# Altium schematic sheet Nixie_MCU.SchDoc
size 420 x 297 mm; ApprovedBy: Софин; CheckedBy: Васильев; Author: Боярцев; DrawnBy: Боярцев; Organization: ТПК "Аргус-НВ"; DocumentNumber: АЦСД.687281.258-01Э3; SheetNumber: 1; SheetTotal: 2; Title1str: Плата управления; PageSetup: Record=PageOptions|CenterHorizontal=False|CenterVertical=False|PrintScale=0.95|XCorrection=0.00|YCorrection=0.00|PrintKind=1|BorderSize=5000000|LeftOffset=0|BottomOffset=0|Orientation=1|PaperLength=1000|PaperWidth=1000|Scale=100|PaperSource=15|PrintQuality=600|MediaType=1|DitherType=10|PaperKind=A4|PrintScaleMode=1; Title2str: ИТП; ProcessInspection: Белов; NormInspection: Печенева; DocumentType: Схема электрическая принципиальная
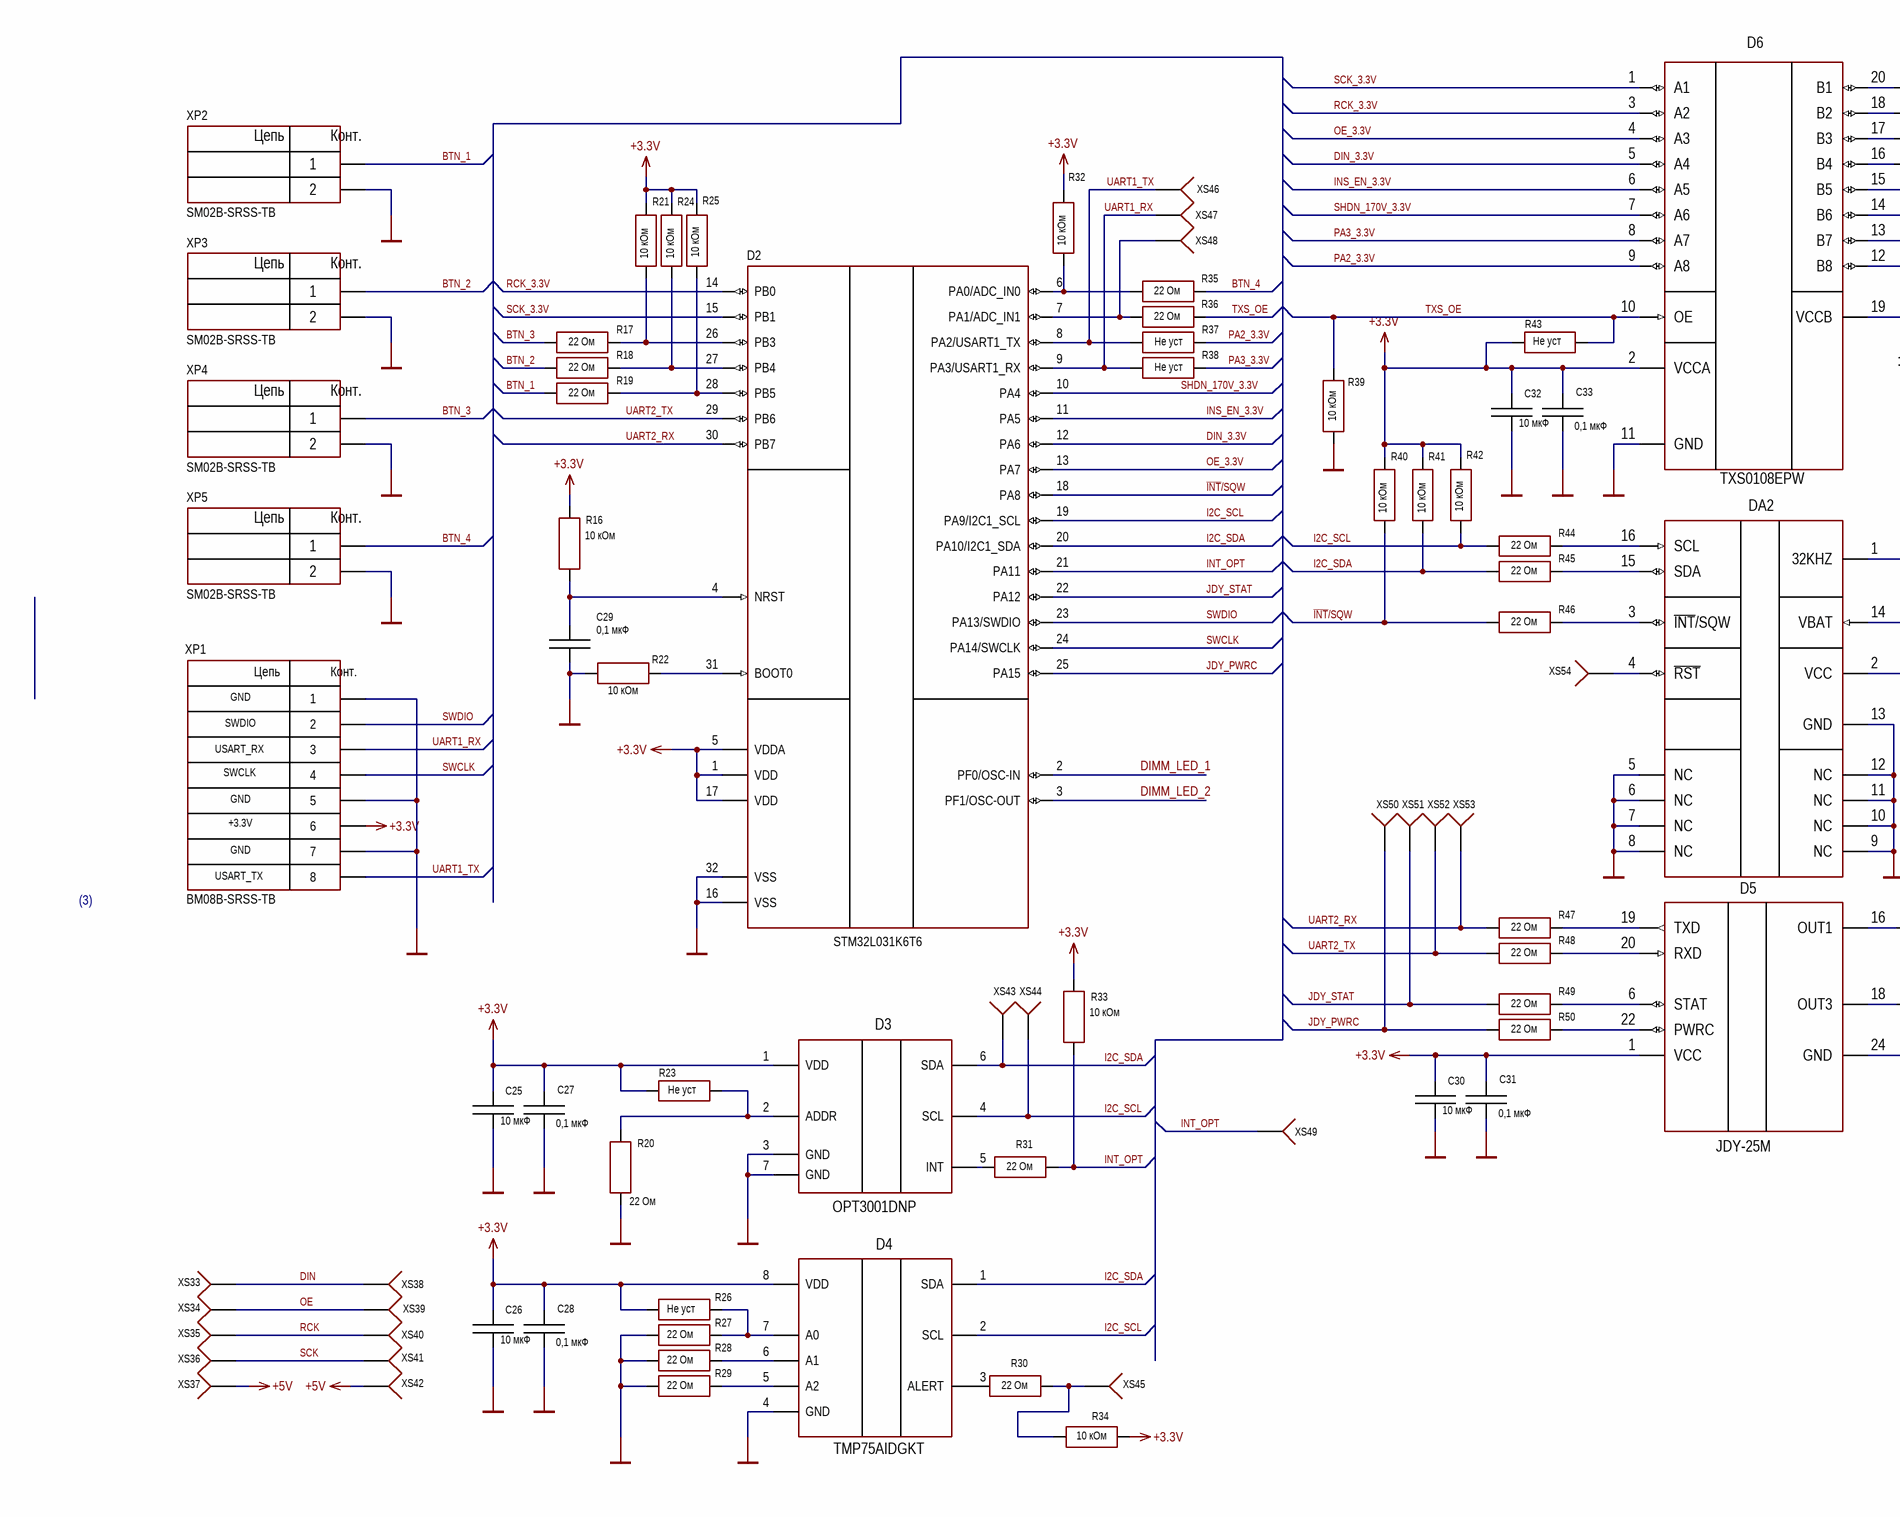
[diagram p0: Nixie_MCU.SchDoc, left]
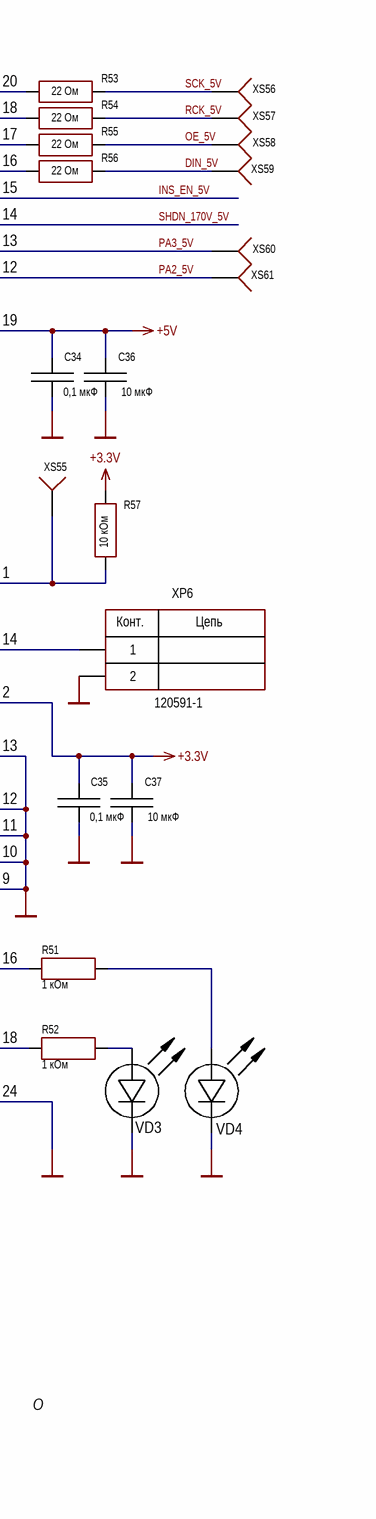
[diagram p1: Nixie_MCU.SchDoc, right]

## Parts
C25  value 10 мкФ  [CAP: 0603R]
C26  value 10 мкФ  [CAP: 0603R]
C27  value 0,1 мкФ  [CAP: 0402R]
C28  value 0,1 мкФ  [CAP: 0402R]
C29  value 0,1 мкФ  [CAP: 0402R]
C30  value 10 мкФ  [CAP: 0603R]
C31  value 0,1 мкФ  [CAP: 0402R]
C32  value 10 мкФ  [CAP: 0603R]
C33  value 0,1 мкФ  [CAP: 0402R]
C34  value 0,1 мкФ  [CAP: 0402R]
C35  value 0,1 мкФ  [CAP: 0402R]
C36  value 10 мкФ  [CAP: 0603R]
C37  value 10 мкФ  [CAP: 0603R]
D2  PartNumber: STM32L031K6T6  [32-LQFP]
D3  PartNumber: OPT3001DNP  [6-USON (OPT)]
D4  (no value)  [8-MSOP]
D5  (no value)  [MOD: JDY-25M]
D6  (no value)  [20-TSSOP]
DA2  (no value)  [16-SOIC]
R16  value 10 кОм  [RES: 0402_ASK]
R17  value 22 Ом  [RES: 0402_ASK]
R18  value 22 Ом  [RES: 0402_ASK]
R19  value 22 Ом  [RES: 0402_ASK]
R20  value 22 Ом  [RES: 0402_ASK]
R21  value 10 кОм  [RES: 0402_ASK]
R22  value 10 кОм  [RES: 0402_ASK]
R23  value Не уст  [RES: 0402_ASK]
R24  value 10 кОм  [RES: 0402_ASK]
R25  value 10 кОм  [RES: 0402_ASK]
R26  value Не уст  [RES: 0402_ASK]
R27  value 22 Ом  [RES: 0402_ASK]
R28  value 22 Ом  [RES: 0402_ASK]
R29  value 22 Ом  [RES: 0402_ASK]
R30  value 22 Ом  [RES: 0402_ASK]
R31  value 22 Ом  [RES: 0402_ASK]
R32  value 10 кОм  [RES: 0402_ASK]
R33  value 10 кОм  [RES: 0402_ASK]
R34  value 10 кОм  [RES: 0402_ASK]
R35  value 22 Ом  [RES: 0402_ASK]
R36  value 22 Ом  [RES: 0402_ASK]
R37  value Не уст  [RES: 0402_ASK]
R38  value Не уст  [RES: 0402_ASK]
R39  value 10 кОм  [RES: 0402_ASK]
R40  value 10 кОм  [RES: 0402_ASK]
R41  value 10 кОм  [RES: 0402_ASK]
R42  value 10 кОм  [RES: 0402_ASK]
R43  value Не уст  [RES: 0402_ASK]
R44  value 22 Ом  [RES: 0402_ASK]
R45  value 22 Ом  [RES: 0402_ASK]
R46  value 22 Ом  [RES: 0402_ASK]
R47  value 22 Ом  [RES: 0402_ASK]
R48  value 22 Ом  [RES: 0402_ASK]
R49  value 22 Ом  [RES: 0402_ASK]
R50  value 22 Ом  [RES: 0402_ASK]
R51  value 1 кОм  [RES: 0402_ASK]
R52  value 1 кОм  [RES: 0402_ASK]
R53  value 22 Ом  [RES: 0402_ASK]
R54  value 22 Ом  [RES: 0402_ASK]
R55  value 22 Ом  [RES: 0402_ASK]
R56  value 22 Ом  [RES: 0402_ASK]
R57  value 10 кОм  [RES: 0402_ASK]
VD3  (no value)  [LED: 0603B]
VD4  (no value)  [LED: 0603B]
XP1  BM08B-SRSS-TB  [CON: BM08B-SRSS-TB]
XP2  (no value)  [CON: SM02B-SRSS-TB]
XP3  (no value)  [CON: SM02B-SRSS-TB]
XP4  (no value)  [CON: SM02B-SRSS-TB]
XP5  (no value)  [CON: SM02B-SRSS-TB]
XP6  120591-1  [CON: 120591-1 (CR2032)]
XS33  (no value)  [CON: PLD-1]
XS34  (no value)  [CON: PLD-1]
XS35  (no value)  [CON: PLD-1]
XS36  (no value)  [CON: PLD-1]
XS37  (no value)  [CON: PLD-1]
XS38  (no value)  [CON: PLD-1]
XS39  (no value)  [CON: PLD-1]
XS40  (no value)  [CON: PLD-1]
XS41  (no value)  [CON: PLD-1]
XS42  (no value)  [CON: PLD-1]
XS43  (no value)  [CON: PLD-1]
XS44  (no value)  [CON: PLD-1]
XS45  (no value)  [CON: PLD-1]
XS46  (no value)  [CON: PLD-1]
XS47  (no value)  [CON: PLD-1]
XS48  (no value)  [CON: PLD-1]
XS49  (no value)  [CON: PLD-1]
XS50  (no value)  [CON: PLD-1]
XS51  (no value)  [CON: PLD-1]
XS52  (no value)  [CON: PLD-1]
XS53  (no value)  [CON: PLD-1]
XS54  (no value)  [CON: PLD-1]
XS55  (no value)  [CON: PLD-1]
XS56  (no value)  [CON: PLD-1]
XS57  (no value)  [CON: PLD-1]
XS58  (no value)  [CON: PLD-1]
XS59  (no value)  [CON: PLD-1]
XS60  (no value)  [CON: PLD-1]
XS61  (no value)  [CON: PLD-1]

## Nets
+3.3V: C25.2 C26.2 C27.2 C28.2 C30.2 C31.2 C32.2 C33.2 C35.2 C37.2 D2.1(VDD) D2.5(VDDA) D2.17(VDD) D3.1(VDD) D4.8(VDD) D5.1(VCC) D6.2(VCCA) DA2.2(VCC) R16.1 R21.1 R23.1 R24.1 R25.1 R26.2 R32.1 R33.2 R34.2 R40.1 R41.1 R42.1 R43.2 R57.1 XP1.6
+5V: C34.2 C36.2 D6.19(VCCB) XS37.1 XS42.1
GND: C25.1 C26.1 C27.1 C28.1 C29.1 C30.1 C31.1 C32.1 C33.1 C34.1 C35.1 C36.1 C37.1 D2.16(VSS) D2.32(VSS) D3.3(GND) D3.7(GND) D4.4(GND) D5.24(GND) D6.11(GND) DA2.5(NC) DA2.6(NC) DA2.7(NC) DA2.8(NC) DA2.9(NC) DA2.10(NC) DA2.11(NC) DA2.12(NC) DA2.13(GND) R20.1 R22.2 R27.2 R28.2 R29.2 R39.1 VD3.2(C) VD4.2(C) XP1.1 XP1.5 XP1.7 XP2.2 XP3.2 XP4.2 XP5.2 XP6.2
BTN_1: R19.1 XP2.1
BTN_2: R18.1 XP3.1
BTN_3: R17.1 XP4.1
BTN_4: R35.1 XP5.1
DIMM_LED_1: D2.2(PF0/OSC-IN)
DIMM_LED_2: D2.3(PF1/OSC-OUT)
DIN: XS33.1 XS38.1
DIN_3.3V: D2.12(PA6) D6.5(A4)
DIN_5V: R56.2 XS59.1
I2C_SCL: D2.19(PA9/I2C1_SCL) D3.4(SCL) D4.2(SCL) R42.2 R44.1 XS44.1
I2C_SDA: D2.20(PA10/I2C1_SDA) D3.6(SDA) D4.1(SDA) R41.2 R45.1 XS43.1
~{INT}/SQW: D2.18(PA8) R40.2 R46.1
INS_EN_3.3V: D2.11(PA5) D6.6(A5)
INS_EN_5V: D6.15(B5)
INT_OPT: D2.21(PA11) R31.2 R33.1 XS49.1
JDY_PWRC: D2.25(PA15) R50.1 XS50.1
JDY_STAT: D2.22(PA12) R49.1 XS51.1
OE: XS34.1 XS39.1
OE_3.3V: D2.13(PA7) D6.4(A3)
OE_5V: R55.2 XS58.1
PA2_3.3V: D6.9(A8) R37.2
PA2_5V: D6.12(B8) XS61.1
PA3_3.3V: D6.8(A7) R38.2
PA3_5V: D6.13(B7) XS60.1
RCK: XS35.1 XS40.1
RCK_3.3V: D2.14(PB0) D6.3(A2)
RCK_5V: R54.2 XS57.1
SCK: XS36.1 XS41.1
SCK_3.3V: D2.15(PB1) D6.1(A1)
SCK_5V: R53.2 XS56.1
SHDN_170V_3.3V: D2.10(PA4) D6.7(A6)
SHDN_170V_5V: D6.14(B6)
SWCLK: D2.24(PA14/SWCLK) XP1.4
SWDIO: D2.23(PA13/SWDIO) XP1.2
TXS_OE: D6.10(OE) R36.1 R39.2 R43.1
UART1_RX: D2.9(PA3/USART1_RX) R38.1 XP1.3 XS47.1
UART1_TX: D2.8(PA2/USART1_TX) R37.1 XP1.8 XS46.1
UART2_RX: D2.30(PB7) R47.1 XS53.1
UART2_TX: D2.29(PB6) R48.1 XS52.1
NetC29_2: C29.2 D2.4(NRST) R16.2
NetD2_6: D2.6(PA0/ADC_IN0) R32.2 R35.2
NetD2_7: D2.7(PA1/ADC_IN1) R36.2 XS48.1
NetD2_26: D2.26(PB3) R17.2 R21.2
NetD2_27: D2.27(PB4) R18.2 R24.2
NetD2_28: D2.28(PB5) R19.2 R25.2
NetD2_31: D2.31(BOOT0) R22.1
NetD3_2: D3.2(ADDR) R20.2 R23.2
NetD3_5: D3.5(INT) R31.1
NetD4_3: D4.3(ALERT) R30.1
NetD4_5: D4.5(A2) R29.1
NetD4_6: D4.6(A1) R28.1
NetD4_7: D4.7(A0) R26.1 R27.1
NetD5_6: D5.6(STAT) R49.2
NetD5_16: D5.16(OUT1) R51.2
NetD5_18: D5.18(OUT3) R52.2
NetD5_19: D5.19(TXD) R47.2
NetD5_20: D5.20(RXD) R48.2
NetD5_22: D5.22(PWRC) R50.2
NetD6_16: D6.16(B4) R56.1
NetD6_17: D6.17(B3) R55.1
NetD6_18: D6.18(B2) R54.1
NetD6_20: D6.20(B1) R53.1
NetDA2_1: DA2.1(32KHZ) R57.2 XS55.1
NetDA2_3: DA2.3(~{INT}/SQW) R46.2
NetDA2_4: DA2.4(~{RST}) XS54.1
NetDA2_14: DA2.14(VBAT) XP6.1
NetDA2_15: DA2.15(SDA) R45.2
NetDA2_16: DA2.16(SCL) R44.2
NetR30_2: R30.2 R34.1 XS45.1
NetR51_1: R51.1 VD4.1(A)
NetR52_1: R52.1 VD3.1(A)

## Notes on the sheet
- GND
- USART_RX
- SWDIO
- SWCLK
- +3.3V
- USART_TX
- (3)
- O
- Перв. примен.
- Справ. №
- Подп. дата
- Инв. № дубл.
- Взам. инв. №
- Подп. и дата
- Изм.
- Разраб.
- Лист
- № докум.
- Боярцев
- Подп.
- Дата
- Лит.
- Масса
- Масштаб
- Пров.
- Т.контр.
- Васильев
- Схема электрическая принципиальная
- Листов
- Инв. № подл.
- Н.контр.
- Утв.
- Коровин
- ООО ТПК "Аргус-НВ"
- ALTIUM GOSTBOM2.0 KEV
- Копировал
- Формат А3
- (in symbol 120591-1) Конт.; Цепь
- (in symbol BM08B-SRSS-TB) Цепь; Конт.
- (in symbol SM02B-SRSS-TB) Цепь; Конт.

## Library data of the parts
C25 C26 C30 C32 C36 C37 = Ceramic_0603: Manufacturer: Yageo; ValueManufacturerPartNumber: Ceramic capacitor, 10 мкФ, X7R, ±10%, 16V, 0603, -55...+125°C; TypeCapacitor: Ceramic capacitor; Tolerance: ±10%; TypeDielectric: X7R; Voltage: 16V; Package: 0603; Temperature: -55...+125°C; Перечень: ="Value"+' '+"Tolerance"+', '+"Volt"+', '+"TypeDielectric"+',  '+"Package"
C27-C29 C31 C33-C35 = Ceramic_0402: Manufacturer: Murata; PartNumber: GCM155R71H104KE02#; TypeCapacitor: Ceramic capacitor; Tolerance: ± 10 %; TypeDielectric: X7R; Volt: 50 В; Перечень: 0,1 мкФ ± 10 %, 50 В, X7R, 0402; Package: 0402; ValueManufacturerPartNumber: =TypeCapacitor+', '+Value+', '+TypeDielectric+', '+Tolerance+', '+Voltage+', '+Package+', '+Temperature; Temperature: -55...+125°C
D2 = STM32F030K6T6: Cortex-M0; Manufacturer: STMicroelectronics; ValueManufacturerPartNumber: IC microcontroller, 32-Bit, Cortex-M0, 48MHz, 32KB, 4KB, 2.4...3.6V, -40...+85°C, 32-LQFP; Supply: 2.4...3.6V; Speed: 48MHz; CoreSize: 32-Bit; MemoryROM: 32KB; MemoryRAM: 4KB; HelpURL: https://www.digikey.com/product-detail/en/stmicroelectronics/STM32F031K4U6/497-13621-ND/3947373; Package: 32-LQFP; ComponentType: IC microcontroller; Temperature: -40...+85°C; CoreProcessor: Cortex-M0; Перечень: STM32L031K6T6
D3 = OPT3001IDNPQ1: Ambient Light Sensor; Manufacturer: Texas Instruments; VoltageInput: 1.6 V to 3.6 V; HelpURL: https://www.ti.com/lit/ds/symlink/opt3001.pdf?ts=1656114666246; Package: USON (6); ComponentType: Ambient Light Sensor; ValueManufacturerPartNumber: =ComponentType+', '+VoltageInput+', '+MaxDropout+', '+VoltageOutput+', '+CurrentOutput+', '+Temperature+', '+Package; Temperature: -40…+85
D4 = TMP75AIDGKT: Digital Temperature Sensor; Manufacturer: Texas Instruments; VoltageInput: 2.7V to 5.5V; HelpURL: https://www.elitan.ru/pdf/0/2/0/5/0/02050737.pdf; Package: MSOP-8; ComponentType: Digital Temperature Sensor; ValueManufacturerPartNumber: =ComponentType+', '+VoltageInput+', '+MaxDropout+', '+VoltageOutput+', '+CurrentOutput+', '+Temperature+', '+Package; Temperature: -40…+85; PartNumber: TMP75AIDGKT
D5 = JDY-25M: bluetooth module; ValueManufacturerPartNumber: bluetooth module, , , , -40...+85°C,; HelpURL: https://www.chipdip.ru/product/esp-07; ComponentType: bluetooth module; Temperature: -40...+85°C; PartNumber: JDY-25M
D6 = TXS0108EPW: Voltage-Level Translator; Manufacturer: Texas Instruments; ValueManufacturerPartNumber: 8-Bit Bidirectional Voltage-Level Translator, 24 Mbps, , 1.2 V to 3.6 V on A port and 1.65 V to 5.5 V on B, -40...+105°C, 20-TSSOP; Supply: 1.2 V to 3.6 V on A port and 1.65 V to 5.5 V on B; DataRate: 24 Mbps; Package: 20-TSSOP; ComponentType: 8-Bit Bidirectional Voltage-Level Translator; Temperature: -40...+105°C; PartNumber: TXS0108EPW
DA2 = DS3231SN: Manufacturer: Vectron; PartNumber: VCC1-B3D-25M0000000; TypeOscilator: Standard Clock Oscillators; LoadCapacitance: 15pF; Tolerance: ±50ppm; Package: 7*5mm; HelpURL: https://www.elitan.ru/price/item7253679; ValueManufacturerPartNumber: =TypeOscilator+', '+Frequency+', '+LoadCapacitance+', '+Tolerance+', '+Package+', '+Temperature; Temperature: -40...+85°C
R16 R21 R22 R24 R25 R32-R34 R39-R42 R57 = Resistor_0402: PartNumber_book: Электроэлемент, резистор RC0402FR-0710KL; Перечень: 10 кОм ±1%, 0.063 Вт, 0402; TypeResistor: Resistor film; Power: 0.063 Вт; Tolerance: ±1%; Package: 0402; Temperature: -55...+125°C; ValueII: *; ValueIII: 0.063 Вт; Parameter 1: *
R17-R20 R27-R31 R35 R36 R44-R50 R53-R56 = Resistor_0402: PartNumber_book: Электроэлемент, резистор RC0402FR-0710KL; Перечень: 22 Ом ±1%, 0.063 Вт, 0402; TypeResistor: Resistor film; Power: 0.063 Вт; Tolerance: ±1%; Package: 0402; Temperature: -55...+125°C; ValueII: *; ValueIII: 0.063 Вт; Parameter 1: *
R23 R26 R37 R38 R43 = Resistor_0402: PartNumber_book: Электроэлемент, резистор RC0402FR-0710KL; Перечень: Не уст ±1%, 0.063 Вт, 0402; TypeResistor: Resistor film; Power: 0.063 Вт; Tolerance: ±1%; Package: 0402; Temperature: -55...+125°C; ValueII: *; ValueIII: 0.063 Вт; Parameter 1: *
R51 R52 = Resistor_0402: Manufacturer: TYCO; PartNumber: 1676480-3; PartNumber_book: Электроэлемент, резистор RC0402FR-0710KL; Перечень: 1 кОм ±1%, 0.063 Вт, 0402; TypeResistor: Resistor film; Power: 0.063 Вт; Tolerance: ±1%; Package: 0402; Temperature: -55...+125°C; ValueII: *; ValueIII: 0.063 Вт; Parameter 1: *
VD3 VD4 = LED_Salut_V1: ValueManufacturerPartNumber: LED, *, *, *, -55...+150°C; TypeDiode: LED; Manufacturer: *; Package: *; HelpURL: *; Temperature: -55...+150°C; Current: *; VoltageDrop: *; PartNumber: *
XP1 = BM08B-SRSS-TB: Manufacturer: jst; ValueManufacturerPartNumber: Connector, 8pin, , 250VAC, 3A; TypeConnector: Connector; VoltageMax: 250VAC; CurrentMax: 3A; Multichannel: 8pin; PartNumber: BM08B-SRSS-TB; CommentText: BM08B-SRSS-TB
XP2-XP5 = SM02B-SRSS-TB: Manufacturer: JST; ValueManufacturerPartNumber: Connector, 2pin, 0.8mm, 50VAC, 1A; TypeConnector: Connector; VoltageMax: 50VAC; Pitch: 0.8mm; CurrentMax: 1A; Multichannel: 2pin; PartNumber: SM02B-SRSS-TB; CommentText: SM02B-SRSS-TB
XP6 = 120591-1: CR2032 Holder; Manufacturer: jst; ValueManufacturerPartNumber: Connector, 2pin, , 250VAC, 3A; TypeConnector: Connector; VoltageMax: 250VAC; CurrentMax: 3A; Multichannel: 2pin; PartNumber: 120591-1; CommentText: 120591-1
XS33-XS61 = Контр.точка: Перечень: Элемент платы; TypeConnector: Connector; CurrentMax: 3A; Multichannel: 1pin